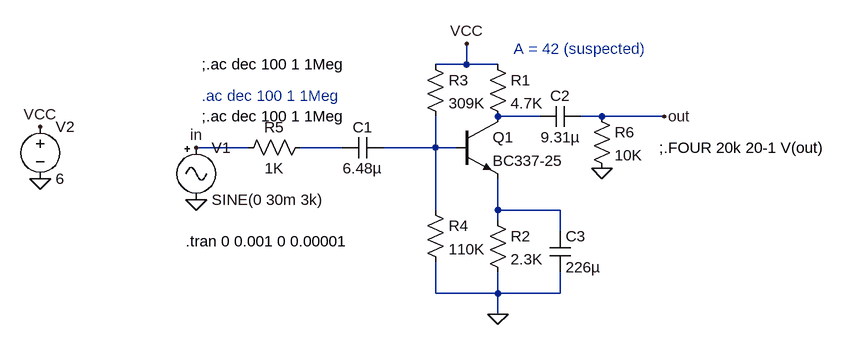
[diagram p0: schematic bjtmixerDraft3.asc]
bjtmixerDraft3.asc, the LTspice schematic file:
Version 4
SHEET 1 912 680
WIRE 176 64 176 32
WIRE 176 64 128 64
WIRE 224 64 176 64
WIRE 288 144 224 144
WIRE 384 144 352 144
WIRE 480 144 384 144
WIRE -160 192 -240 192
WIRE -16 192 -80 192
WIRE 128 192 128 144
WIRE 128 192 48 192
WIRE 160 192 128 192
WIRE 128 288 128 192
WIRE 224 288 224 240
WIRE 320 288 224 288
WIRE 224 304 224 288
WIRE 320 320 320 288
WIRE 128 416 128 368
WIRE 224 416 224 384
WIRE 224 416 128 416
WIRE 320 416 320 384
WIRE 320 416 224 416
WIRE 224 448 224 416
FLAG 224 448 0
FLAG 176 32 VCC
FLAG 384 224 0
FLAG -240 272 0
FLAG 480 144 out
FLAG -240 192 in
FLAG -480 240 0
FLAG -480 160 VCC
SYMBOL cap 48 176 R90
WINDOW 0 0 32 VBottom 2
WINDOW 3 32 32 VTop 2
SYMATTR InstName C1
SYMATTR Value 6.48µ
SYMBOL npn 160 144 R0
SYMATTR InstName Q1
SYMATTR Value BC337-25
SYMBOL res 208 48 R0
SYMATTR InstName R1
SYMATTR Value 4.7K
SYMBOL res 208 288 R0
SYMATTR InstName R2
SYMATTR Value 2.3K
SYMBOL res 112 48 R0
SYMATTR InstName R3
SYMATTR Value 309K
SYMBOL res 112 272 R0
SYMATTR InstName R4
SYMATTR Value 110K
SYMBOL cap 352 128 R90
WINDOW 0 0 32 VBottom 2
WINDOW 3 32 32 VTop 2
SYMATTR InstName C2
SYMATTR Value 9.31µ
SYMBOL cap 304 320 R0
SYMATTR InstName C3
SYMATTR Value 226µ
SYMBOL res -64 176 R90
WINDOW 0 0 56 VBottom 2
WINDOW 3 32 56 VTop 2
SYMATTR InstName R5
SYMATTR Value 1K
SYMBOL res 368 128 R0
SYMATTR InstName R6
SYMATTR Value 10K
SYMBOL Misc\\signal -240 176 R0
WINDOW 123 24 132 Left 2
WINDOW 39 0 0 Left 0
SYMATTR InstName V1
SYMATTR Value SINE(0 30m 3k)
SYMBOL voltage -480 144 R0
WINDOW 123 0 0 Left 0
WINDOW 39 0 0 Left 0
SYMATTR InstName V2
SYMATTR Value 6
TEXT 248 40 Left 2 ;A = 42 (suspected)
TEXT -232 112 Left 2 ;.ac dec 100 1 1Meg
TEXT 472 192 Left 2 !;.FOUR 20k 20-1 V(out)
TEXT -232 64 Left 2 !;.ac dec 100 1 1Meg
TEXT -232 144 Left 2 !;.ac dec 100 1 1Meg
TEXT -256 336 Left 2 !.tran 0 0.001 0 0.00001

The netlist it stands for:
* bjtmixerDraft3.asc
C1 N003 N002 6.48µ
Q1 N001 N003 N004 0 BC337-25
R1 VCC N001 4.7K
R2 N004 0 2.3K
R3 VCC N003 309K
R4 N003 0 110K
C2 out N001 9.31µ
C3 N004 0 226µ
R5 N002 in 1K
R6 out 0 10K
V1 in 0 SINE(0 30m 3k)
V2 VCC 0 6
.model NPN NPN
.model PNP PNP
.lib standard.bjt
* A = 42 (suspected)
* .ac dec 100 1 1Meg
;.FOUR 20k 20-1 V(out)
;.ac dec 100 1 1Meg
;.ac dec 100 1 1Meg
.tran 0 0.001 0 0.00001
.backanno
.end